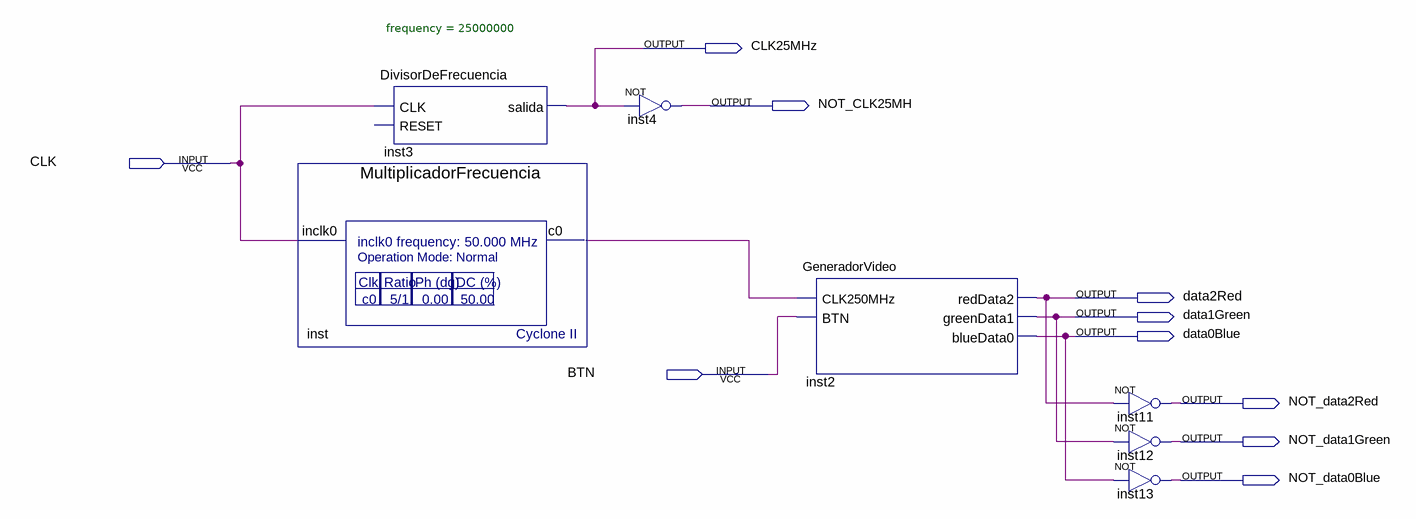
[diagram p0: schematic sheet]
// Quartus schematic PruebaHDMI.bdf as structural Verilog: 7 symbols, 10 pins
module PruebaHDMI (
  input  CLK,
  input  BTN,
  output CLK25MHz,
  output NOT_CLK25MH,
  output data2Red,
  output data1Green,
  output data0Blue,
  output NOT_data2Red,
  output NOT_data1Green,
  output NOT_data0Blue
);

  wire inst_c0;

  MultiplicadorFrecuencia inst (.inclk0(CLK), .c0(inst_c0));
  DivisorDeFrecuencia #(.frequency(25000000)) inst3 (.CLK(CLK), .salida(CLK25MHz));  // open: RESET
  not inst4 (NOT_CLK25MH, CLK25MHz);
  GeneradorVideo inst2 (
    .CLK250MHz(inst_c0), .BTN(BTN), .redData2(data2Red), .greenData1(data1Green), .blueData0(data0Blue));
  not inst11 (NOT_data2Red, data2Red);
  not inst12 (NOT_data1Green, data1Green);
  not inst13 (NOT_data0Blue, data0Blue);
endmodule
